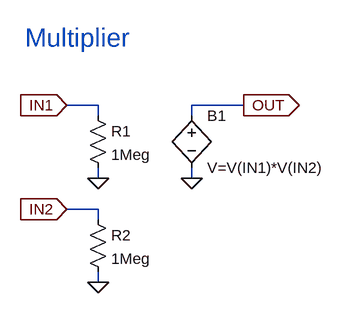
[diagram p0: schematic MUL.asc]
MUL.asc, the LTspice schematic file:
Version 4
SHEET 1 880 680
WIRE 96 48 48 48
WIRE 320 48 240 48
WIRE 96 64 96 48
WIRE 240 64 240 48
WIRE 96 160 96 144
WIRE 240 160 240 144
WIRE 96 208 48 208
WIRE 96 224 96 208
WIRE 96 320 96 304
FLAG 48 48 IN1
IOPIN 48 48 In
FLAG 48 208 IN2
IOPIN 48 208 In
FLAG 240 160 0
FLAG 320 48 OUT
IOPIN 320 48 Out
FLAG 96 160 0
FLAG 96 320 0
SYMBOL bv 240 48 R0
SYMATTR InstName B1
SYMATTR Value V=V(IN1)*V(IN2)
SYMBOL res 80 48 R0
SYMATTR InstName R1
SYMATTR Value 1Meg
SYMBOL res 80 208 R0
SYMATTR InstName R2
SYMATTR Value 1Meg
TEXT -16 -56 Left 4 ;Multiplier

The netlist it stands for:
* MUL.asc
B1 OUT 0 V=V(IN1)*V(IN2)
R1 IN1 0 1Meg
R2 IN2 0 1Meg
* Multiplier
.backanno
.end